# Altium schematic sheet QPA2609.SchDoc: FMC SDR Frontend
size 420 x 297 mm; CheckedBy: -; CompanyName: CERN; DrawnBy: DrawnBy; Organization: CERN; Address1: European Organization for Nuclear Research; Address2: CH-1211 Genčve 23 - Switzerland; Revision: -; SheetNumber: -; SheetTotal: -; EDA_Number: EDA-XXXXX-VX-X; Projet: -; ModifiedBy: -; CreateDate: XX/XX/XXXX; CheckedDate: -; Title2: LNA; DivGrp: TE/MPE; Designer: Designer; ModifiedDate: -
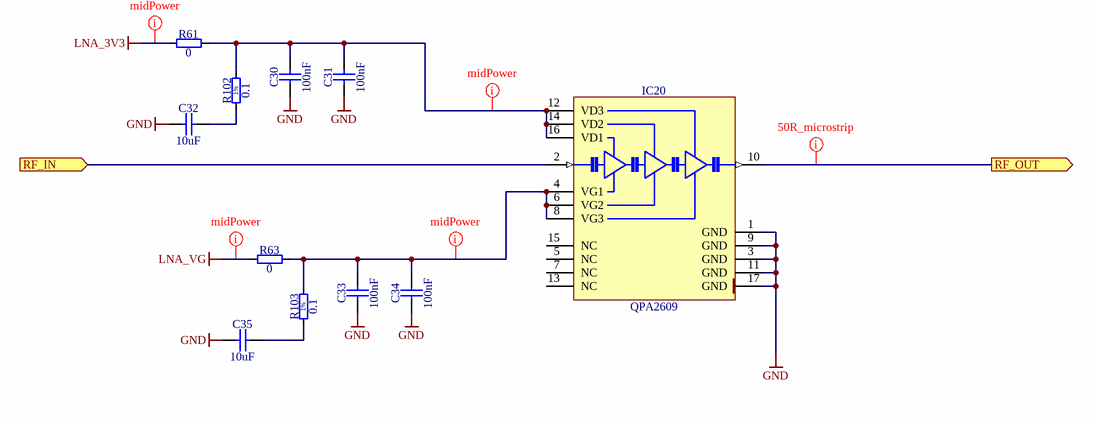
[diagram p0: QPA2609.SchDoc]

## Parts
C30  100nF  [CAPC1005X55N]
C31  100nF  [CAPC1005X55N]
C32  10uF  [CAPC2012X135N]
C33  100nF  [CAPC1005X55N]
C34  100nF  [CAPC1005X55N]
C35  10uF  [CAPC2012X135N]
IC20  QPA2609  [QORVO_QPA2609]
R61  0  [RESC1608X55N]
R63  0  [RESC1608X55N]
R102  0.1  [RESC1005X40N]
R103  0.1  [RESC1005X40N]

## Ports
RF_IN (in), RF_OUT (out)

## Nets
GND: C30.1 C31.1 C32.1 C33.1 C34.1 C35.1 IC20.1(GND) IC20.3(GND) IC20.9(GND) IC20.11(GND) IC20.17(GND)
LNA_3V3: R61.1
LNA_VG: R63.1
RF_IN: IC20.2(RF_IN) ; port RF_IN
RF_OUT: IC20.10(RF_OUT) ; port RF_OUT
NetC30_2: C30.2 C31.2 IC20.12(VD3) IC20.14(VD2) IC20.16(VD1) R61.2 R102.2
NetC32_2: C32.2 R102.1
NetC33_2: C33.2 C34.2 IC20.4(VG1) IC20.6(VG2) IC20.8(VG3) R63.2 R103.2
NetC35_2: C35.2 R103.1

Not connected (* = marked no-connect by the designer): IC20 5(NC) 7(NC) 13(NC) 15(NC)

## Layout directives
net class midPower: LNA_3V3, LNA_VG, NetC30_2, NetC33_2
net class 50R_class: RF_OUT

## Notes on the sheet
- Project/Equipment
- Document
- Designer
- Drawn by
- Check.by
- File
- Last Mod.
- Print Date
- Sheet
- Size
- A3
- of
- Rev
- (in symbol R0402_0.1R_1%_0.0625W_100PPM) 1%

## Library data of the parts
C30 C31 C33 C34 = CC0402_100NF_16V_10%_X7R: Non-polarised capacitor; Part Description: SMD Multilayer Chip Ceramic Capacitor; Manufacturer: GENERIC; Manufacturer1 Part Number: GRM155R71C104KA88D; Voltage: 16V; TC: X7R; Tolerance: ±10%; Part Number: CC0402_100NF_16V_10%_X7R; Component Kind: Standard; Component Type: Standard; Pin Count: 2; Value: 100nF; Status: Not Recommended; Manufacturer Part Number: CC0402_100NF_16V_10%_X7R; Case: 0402; Mounted: Yes; Socket: No; SMD: Yes; Sense: No; Manufacturer1 Example: MURATA; Manufacturer1 ComponentHeight: 0.55mm; HelpURL: \\cern.ch\dfs\Applications\Altium\Datasheets\CC0402_X7R_MURATA_GRM.pdf; Author: CERN DEM JLC; CreateDate: 05.12.2013; LatestRevisionDate: 03.12.2007
C32 C35 = CC0805_10UF_10V_10%_X7R: Non-polarised capacitor; Part Description: SMD Multilayer Chip Ceramic Capacitor; Manufacturer: GENERIC; Manufacturer1 Part Number: GRM21BR71A106KE51L; Voltage: 10V; TC: X7R; Tolerance: ±10%; Part Number: CC0805_10UF_10V_10%_X7R; Component Kind: Standard; Component Type: Standard; Pin Count: 2; Value: 10uF; Status: Preferred; Manufacturer Part Number: CC0805_10UF_10V_10%_X7R; Case: 0805; Mounted: Yes; Socket: No; SMD: Yes; Sense: No; Manufacturer1 Example: MURATA; Manufacturer1 ComponentHeight: 1.35mm; HelpURL: \\cern.ch\dfs\Applications\Altium\Datasheets\CC0805_X7R_MURATA.pdf; Author: CERN DEM JLC; CreateDate: 30.04.2012; LatestRevisionDate: 30.04.2012
IC20 = QPA2609: 7-14GHz GaAs Low Noise Amplifier; Manufacturer: QORVO; PressFit: No; Bonding: No; Part Number: QPA2609; Component Kind: Standard; Component Type: Standard; Device: QPA2609; PackageDescription: QFN, 0.50mm Pitch, Square; 16 Pin, 4.00mm L X 4.00mm W X 0.9mm H Body (w/thermal Tab 2.75 X 2.75mm); Part Description: 7-14GHz GaAs Low Noise Amplifier; Manufacturer Part Number: QPA2609; Pin Count: 17; Case: QFN16; Mounted: Yes; Socket: No; SMD: Yes; Sense: No; ComponentHeight: 0.9mm; Author: CERN DEM JLC; HelpURL: \\cern.ch\dfs\Applications\Altium\Datasheets\QPA2609.pdf; CreateDate: 01.04.2019; LatestRevisionDate: 01.04.2019
R61 R63 = R0603_0R_JUMPER: Resistor; Part Description: 1A (0.05R Max DC Resistance) Zero Ohm Jumper; Manufacturer: GENERIC; Manufacturer1 Part Number: NRC06Z0; PressFit: No; Part Number: R0603_0R_JUMPER; Component Kind: Standard; Component Type: Standard; Pin Count: 2; Value: 0; Status: Preferred; Manufacturer Part Number: R0603_0R_JUMPER; Case: 0603; Mounted: Yes; Sense: No; Socket: No; SMD: Yes; Manufacturer1 Example: NIC COMPONENT; Manufacturer1 ComponentHeight: 0.55mm; HelpURL: \\cern.ch\dfs\Applications\Altium\Datasheets\R0603_NIC_NRC.pdf; Author: CERN DEM JLC; CreateDate: 03.12.2007; LatestRevisionDate: 13.03.2008
R102 R103 = R0402_0.1R_1%_0.0625W_100PPM: Resistor - 1%; Part Description: General Purpose Thick Film Chip Resistor; Manufacturer: GENERIC; Manufacturer1 Part Number: 232270671007L; TC: ±100ppm/°C; PressFit: No; Part Number: R0402_0.1R_1%_0.0625W_100PPM; Component Kind: Standard; Component Type: Standard; Pin Count: 2; Value: 0.1; Status: Not Recommended; Power: 0.0625W; Tolerance: ±1%; Manufacturer Part Number: R0402_0.1R_1%_0.0625W_100PPM; Case: 0402; Mounted: Yes; Sense: No; Socket: No; SMD: Yes; Manufacturer1 Example: YAGEO PHYCOMP; Manufacturer1 ComponentHeight: 0.4mm; HelpURL: \\cern.ch\dfs\Applications\Altium\Datasheets\R0402_Phycomp_RC0402.pdf; Author: CERN DEM MR; CreateDate: 15.03.2016; LatestRevisionDate: 15.03.2016